# EAGLE schematic windsensor-esp12-v002 (EAGLE 7.5.0)

## Sheet 1 of 2
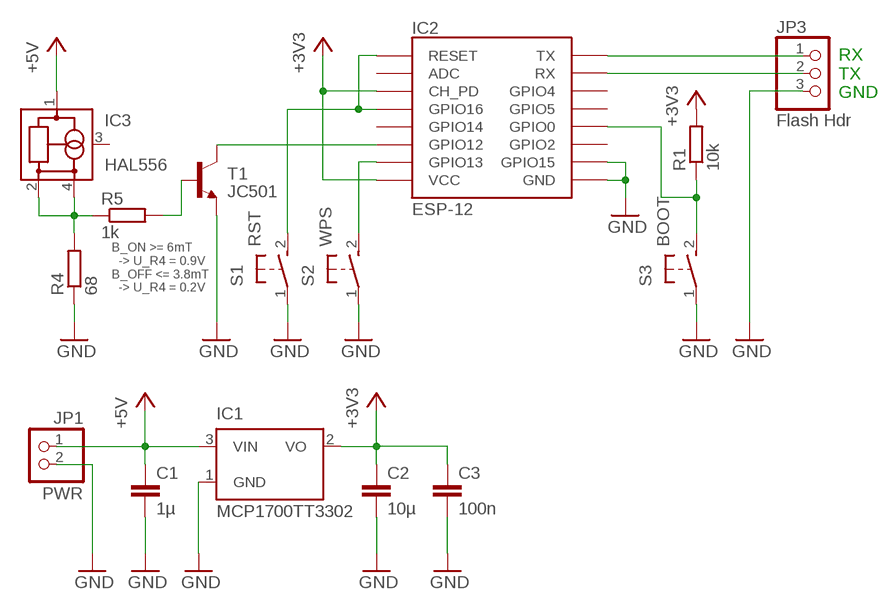
[diagram p0: schematic, sheet 1]

### Parts
C1  1µ  C-EUC0805  [C0805]
C2  10µ  C-EUC0805  [C0805]
C3  100n  C-EUC0805  [C0805]
IC1  MCP1700TT3302  MCP1700TT  [SOT23]
IC2  ESP-12  [ESP-12]
IC3  HAL556  [SOT89]
JP1  PWR  PINHD-1X2  [1X02]
JP3  Flash Hdr  PINHD-1X3  [1X03]
R1  10k  R-EU_R0805HS  [R0805HS]
R4  68  R-EU_R0805HS  [R0805HS]
R5  1k  R-EU_R0805HS2  [R0805HS2]
S1  RST  TS1  [TS1]
S2  WPS  TS1  [TS1]
S3  BOOT  TS1  [TS1]
T1  JC501  [TO92-ECB]

### Nets
+3V3: C2.1 C3.1 IC1.2(VO) IC2.CH_PD IC2.VCC R1.2
+5V: C1.1 IC1.3(VIN) IC3.1 JP1.1
GND: C1.2 C2.2 C3.2 IC1.1(GND) IC2.GND IC2.GPIO15 JP1.2 JP3.3 R4.1 S1.1 S2.1 S3.1 T1.E
N$1: R5.2 T1.B
N$2: IC2.TX JP3.1
N$3: IC2.RX JP3.2
N$4: IC2.GPIO16 IC2.RESET S1.2
N$6: IC2.GPIO0 R1.1 S3.2
N$8: IC2.GPIO13 S2.2
N$9: IC2.GPIO12 T1.C
N$10: IC3.2 IC3.4 R4.2 R5.1
Unconnected: IC2.ADC IC2.GPIO2 IC2.GPIO4 IC2.GPIO5 IC2.GPIO14 IC3.3

### Notes on the sheet
- RX
  TX
  GND
- B_ON >= 6mT
    -> U_R4 = 0.9V
  B_OFF <= 3.8mT
    -> U_R4 = 0.2V

## Sheet 2 of 2

## Library data of the parts
C1-C3 = rcl:C-EU: CAPACITOR, European symbol
IC1 = mr-microchip:MCP1700: 1.2V to 5.0V low dropout voltage regulator The MCP1700 is a family of CMOS low dropout (LDO) voltage regulators that can deliver up to 250 mA of current while consuming only 1.6 μA of quiescent current (typical). Source: http://www.microchip.com
IC2 = esp8266modules:ESP-12: ESP8266 Wifi module 12
IC3 = mr-hal-sensor:HAL556: Two-Wire Hall-Effect Sensors MICRONAS HAL556
JP1 = mr-con:PINHD-1X2: PIN HEADER
JP3 = mr-con:PINHD-1X3: PIN HEADER
R1 R4 R5 = mr-rcl:R-EU_: RESISTOR, European symbol
S1-S3 = mr-switch:TS1: SWITCH 1 pole, 2 pins; POLLIN: 420 502
T1 = mr-transistor:JC501: NPN general purpose transistor E-C-B VCEO max. 45 V IC max. 100 mA